# Altium project Table Clock.PrjPcb
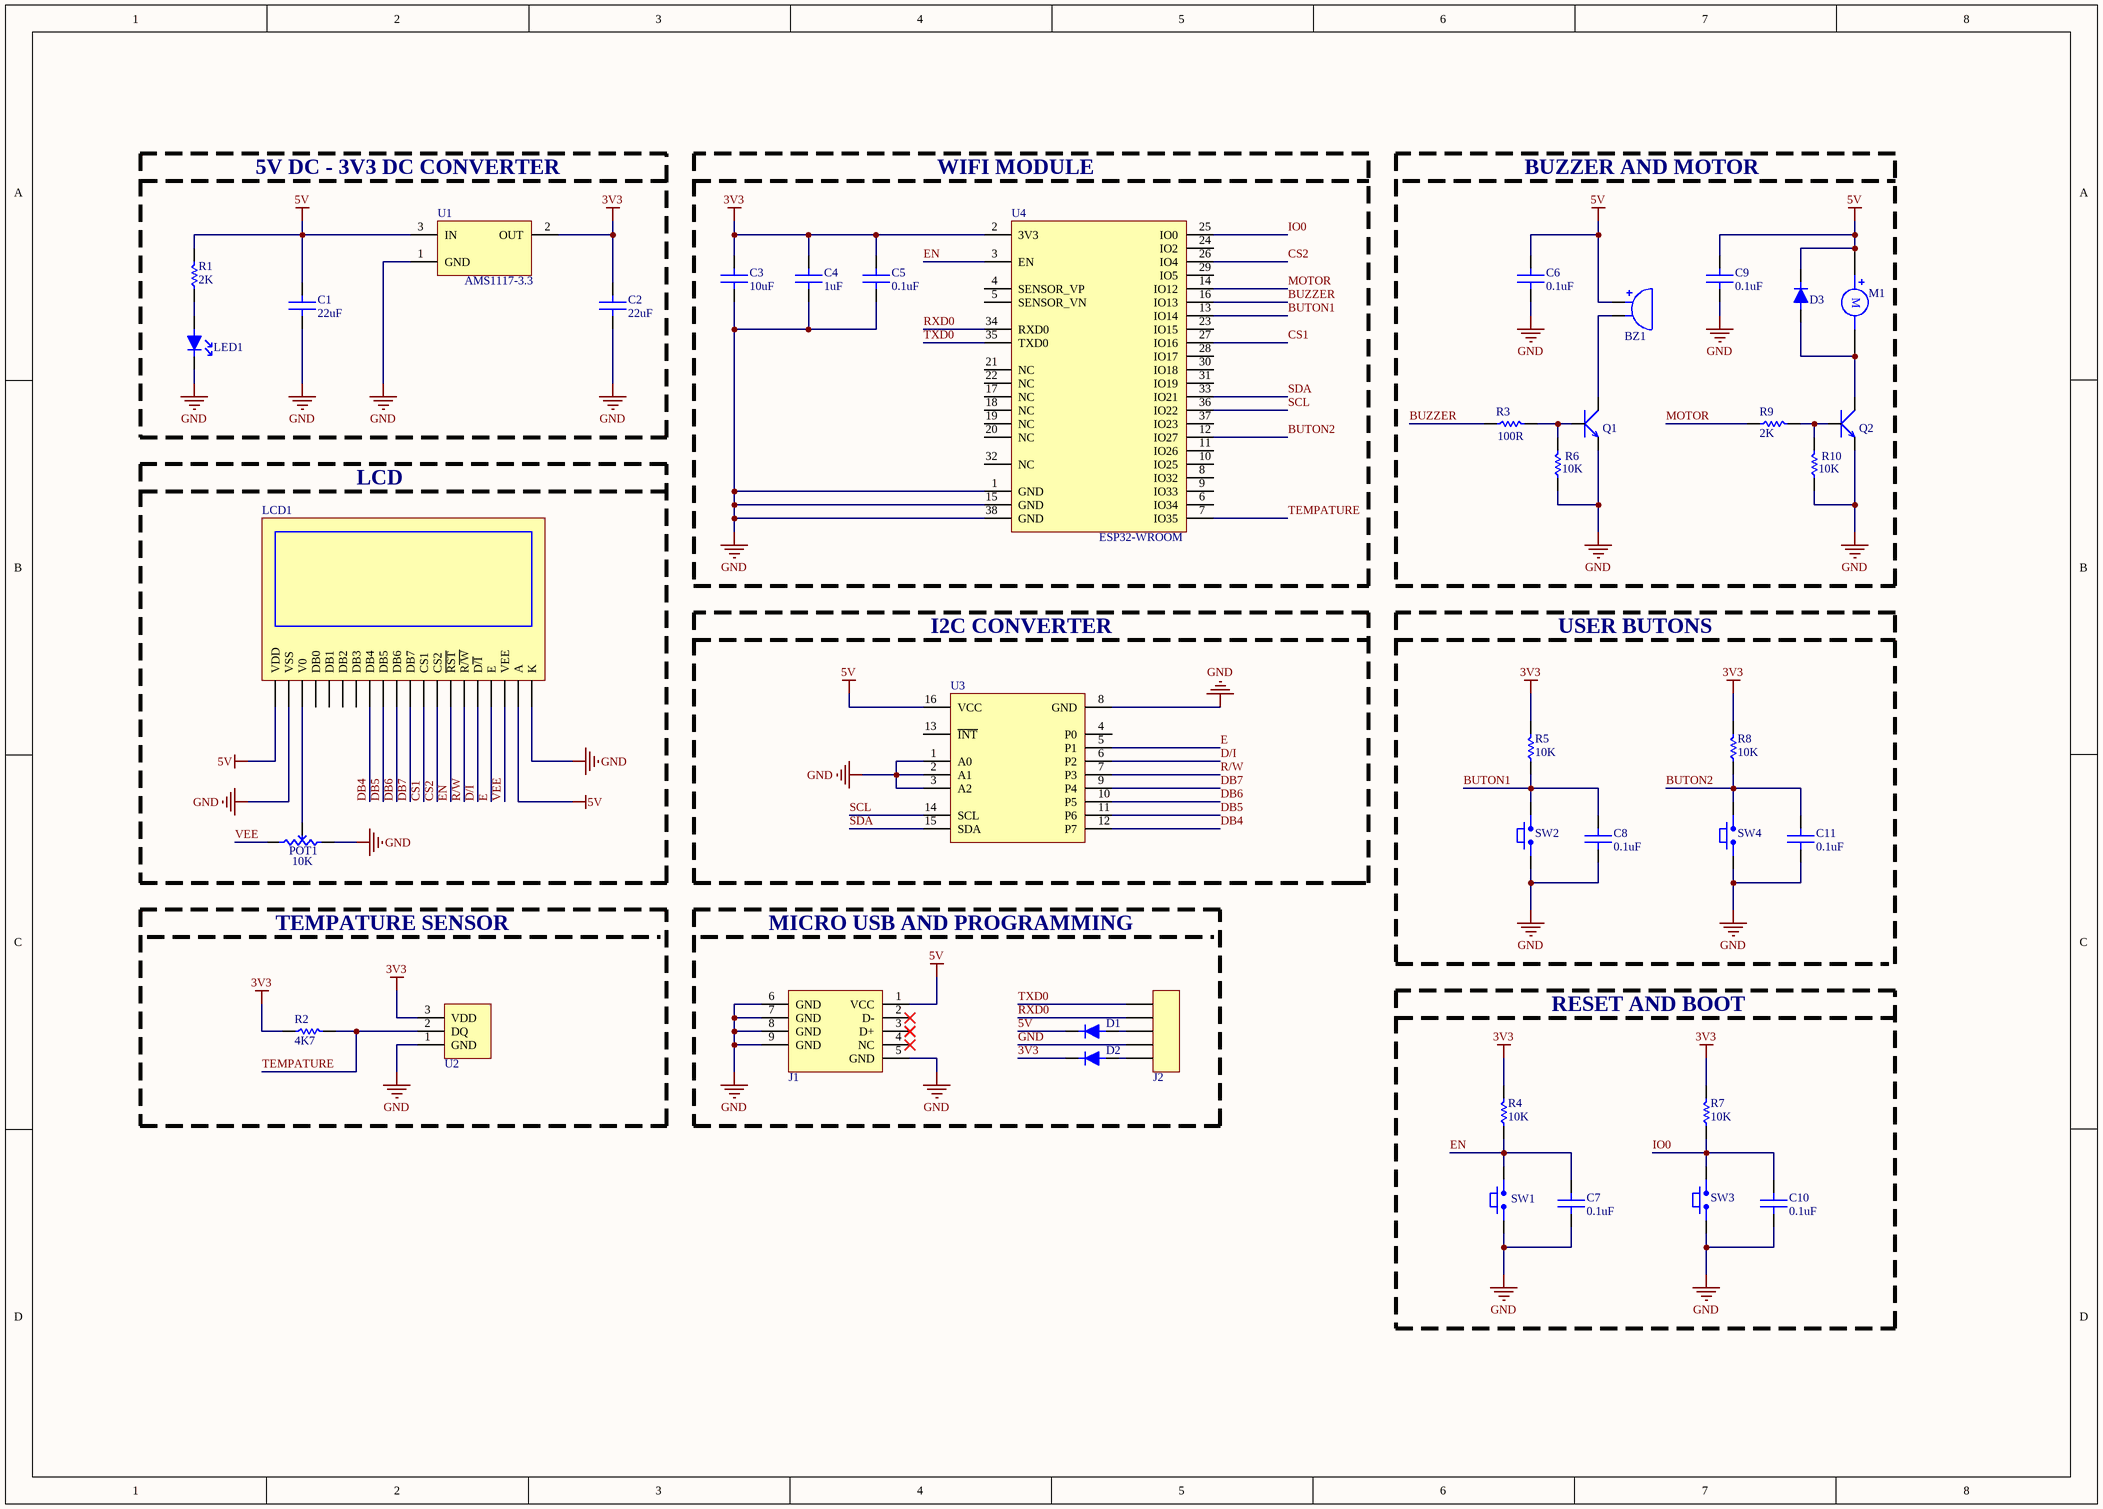
[diagram p0: Table Clock.SchDoc]
1 sheet, 41 parts. Net scope: global (net labels, ports and power ports of the same name join across sheets).
Board file: Table Clock.PcbDoc

## Sheet Table Clock.SchDoc
size A3; SheetNumber: 1; SheetTotal: 1

### Parts
BZ1  CMI-9605IC-0580T  [BUZZER]  (value not drawn)
C1  value 22uF  [CAP 0805]  (hidden comment: GRM21BR61E226ME44L)
C2  value 22uF  [CAP 0805]  (hidden comment: GRM21BR61E226ME44L)
C3  value 10uF  [CAP 0805]  (hidden comment: CC0805KKX5R8BB106)
C4  value 1uF  [CAP 0805]  (hidden comment: CC0805KKX7R9BB105)
C5  value 0.1uF  [CAP 0805]  (hidden comment: CC0805KRX7R9BB104)
C6  value 0.1uF  [CAP 0805]  (hidden comment: CC0805KRX7R9BB104)
C7  value 0.1uF  [CAP 0805]  (hidden comment: CC0805KRX7R9BB104)
C8  value 0.1uF  [CAP 0805]  (hidden comment: CC0805KRX7R9BB104)
C9  value 0.1uF  [CAP 0805]  (hidden comment: CC0805KRX7R9BB104)
C10  value 0.1uF  [CAP 0805]  (hidden comment: CC0805KRX7R9BB104)
C11  value 0.1uF  [CAP 0805]  (hidden comment: CC0805KRX7R9BB104)
D1  MBR230LSFT1G  [DIODE]  (value not drawn)
D2  MBR230LSFT1G  [DIODE]  (value not drawn)
D3  MBR230LSFT1G  [DIODE]  (value not drawn)
J1  UJ2-MIBH-G-SMT-TR  [MICRO USB]  (value not drawn)
J2  61300511121  [HEADER 5 POS]  (value not drawn)
LCD1  NHD-12864WG-BTFH-V#N  [LCD SCREEN]  (value not drawn)
LED1  150080RS75000  [LED 0805]  (value not drawn)
M1  HD-EM1003-LW15-R  [Motor]  (value not drawn)
POT1  value 10K  [TRIMMER]  (hidden comment: 3362P-1-103LF)
Q1  SS8050-G  [SOT23-3]  (value not drawn)
Q2  SS8050-G  [SOT23-3]  (value not drawn)
R1  value 2K  [RES 0603]  (hidden comment: CRGH0603J2K0)
R2  value 4K7  [RES 0603]  (hidden comment: CRGH0603J4K7)
R3  value 100R  [RES 0603]  (hidden comment: CRGH0603J100R)
R4  value 10K  [RES 0603]  (hidden comment: CRGH0603J10K)
R5  value 10K  [RES 0603]  (hidden comment: CRGH0603J10K)
R6  value 10K  [RES 0603]  (hidden comment: CRGH0603J10K)
R7  value 10K  [RES 0603]  (hidden comment: CRGH0603J10K)
R8  value 10K  [RES 0603]  (hidden comment: CRGH0603J10K)
R9  value 2K  [RES 0603]  (hidden comment: CRGH0603J2K0)
R10  value 10K  [RES 0603]  (hidden comment: CRGH0603J10K)
SW1  PTS636SM43SMTR LFS  [BUTTON]  (value not drawn)
SW2  PTS636SM50 LFS  [HEADER 2 POS]  (value not drawn)
SW3  PTS636SM43SMTR LFS  [BUTTON]  (value not drawn)
SW4  PTS636SM50 LFS  [HEADER 2 POS]  (value not drawn)
U1  AMS1117-3.3  [SOT 223]
U2  DS18B20  [HEADER 3 POS]  (value not drawn)
U3  PCF8574ADWR  [SOIC-16]  (value not drawn)
U4  value ESP32-WROOM  [ESP32]  (hidden comment: ESP32-WROOM-32E-H4)

### Blocks framed on the sheet
5V DC - 3V3 DC CONVERTER: C1 C2 LED1 R1 U1
WIFI MODULE: C3-C5 U4
BUZZER AND MOTOR: BZ1 C6 C9 D3 M1 Q1 Q2 R3 R6 R9 R10
LCD: LCD1 POT1
I2C CONVERTER: U3
MICRO USB AND PROGRAMMING: D1 D2 J1 J2
RESET AND BOOT: C7 C10 R4 R7 SW1 SW3

### Nets
3V3: C2.2 C3.2 C4.2 C5.2 D2.2 R2.1 R4.2 R5.2 R7.2 R8.2 U1.2(OUT) U2.3(VDD) U4.2(3V3)
5V: BZ1.1 C1.2 C6.2 C9.2 D1.2 D3.2 J1.1(VCC) LCD1.1(VDD) LCD1.19(A) M1.1 R1.2 U1.3(IN) U3.16(VCC)
GND: C1.1 C2.1 C3.1 C4.1 C5.1 C6.1 C7.1 C8.1 C9.1 C10.2 C11.1 J1.5(GND) J1.6(GND) J1.7(GND) J1.8(GND) J1.9(GND) J2.4 LCD1.2(VSS) LCD1.20(K) LED1.2 POT1.3 Q1.2 Q2.2 R6.1 R10.1 SW1.1 SW2.1 SW3.1 SW4.1 U1.1(GND) U2.1(GND) U3.1(A0) U3.2(A1) U3.3(A2) U3.8(GND) U4.1(GND) U4.15(GND) U4.38(GND)
BUTON1: C8.2 R5.1 SW2.2 U4.13(IO14)
BUTON2: C11.2 R8.1 SW4.2 U4.12(IO27)
BUZZER: R3.1 U4.16(IO13)
CS1: LCD1.12(CS1) U4.27(IO16)
CS2: LCD1.13(CS2) U4.26(IO4)
D/I: LCD1.16(D~{/I}) U3.6(P2)
DB4: LCD1.8(DB4) U3.12(P7)
DB5: LCD1.9(DB5) U3.11(P6)
DB6: LCD1.10(DB6) U3.10(P5)
DB7: LCD1.11(DB7) U3.9(P4)
E: LCD1.17(E) U3.5(P1)
EN: C7.2 LCD1.14(~{RST}) R4.1 SW1.2 U4.3(EN)
IO0: C10.1 R7.1 SW3.2 U4.25(IO0)
MOTOR: R9.1 U4.14(IO12)
R/W: LCD1.15(R~{/W}) U3.7(P3)
RXD0: J2.2 U4.34(RXD0)
SCL: U3.14(SCL) U4.36(IO22)
SDA: U3.15(SDA) U4.33(IO21)
TEMPATURE: R2.2 U2.2(DQ) U4.7(IO35)
TXD0: J2.1 U4.35(TXD0)
VEE: LCD1.18(VEE) POT1.1
NetBZ1_2: BZ1.2 Q1.3
NetD1_1: D1.1 J2.3
NetD2_1: D2.1 J2.5
NetD3_1: D3.1 M1.2 Q2.3
NetLCD1_3: LCD1.3(V0) POT1.2
NetLED1_1: LED1.1 R1.1
NetQ1_1: Q1.1 R3.2 R6.2
NetQ2_1: Q2.1 R9.2 R10.2

Not connected (* = marked no-connect by the designer): J1 2(D-)* 3(D+)* 4(NC)*; LCD1 4(DB0) 5(DB1) 6(DB2) 7(DB3); U3 4(P0) 13(~{INT}); U4 4(SENSOR_VP) 5(SENSOR_VN) 6(IO34) 8(IO32) 9(IO33) 10(IO25) 11(IO26) 17(NC) 18(NC) 19(NC) 20(NC) 21(NC) 22(NC) 23(IO15) 24(IO2) 28(IO17) 29(IO5) 30(IO18) 31(IO19) 32(NC) 37(IO23)

### Notes on the sheet
- USER BUTONS
- TEMPATURE SENSOR
- Dosya Adı / File Name
- Hazırlayan / Prepared By
- Tanım / Description
- Değiştirme Tarihi / Changed Date
- Bölüm / Department
- Onaylayan / Approved By
- Kontrol Eden / Checked By
- Boyut / Size
- Sayfa / Sheet
- Revizyon / Revision
- (in symbol VIBRATION DC MOTOR) M

### Library data of the parts
BZ1 = BUZZER: BUZZER MAGNETIC 5V 9.6MM TH
C1 C2 = CAP CER 22UF 0805: CAP CER 22UF 25V X5R 0805
C3 = CAP CER 10UF 0805: CAP CER 10UF 25V X5R 0805
C4 = CAP CER 1UF 0805: CAP CER 1UF 50V X7R 0805
C5-C11 = CAP CER 0.1UF 0805: CAP CER 0.1UF 50V X7R 0805
D1-D3 = DIODE SMD: DIODE SCHOTTKY 30V 2A
J1 = MICRO USB: USB JACK 2.0 MICRO B TYPE 5 P
J2 = HEADER 5 POS: CONN HEADER 5POS 2.54MM
LCD1 = LCD SCREEN: GRAPHIC DISPLAY LCD TH
LED1 = RED LED 0805: LED RED 0805 SMD
M1 = VIBRATION DC MOTOR: HD MOTOR 3VDC 46OHM 12000RPM
POT1 = TRIMMER: TRIMMER 10K OHM 0.5W PC PIN TOP
Q1 Q2 = NPN TRANSISTOR: TRANS NPN 25V 1.5A SOT-23-3
R1 R9 = RES 2K OHM 0603: RES 2K OHM 5% 1/5W 0603
R2 = RES 4K7 OHM 0603: RES 4.7K OHM 5% 1/5W 0603
R3 = RES 100 OHM 0603: RES 100 OHM 5% 1/5W 0603
R4-R8 R10 = RES 10K OHM 0603: RES 10K OHM 5% 1/5W 0603
SW1 SW3 = BUTTON: SWITCH TACTILE 0.05A 12V
SW2 SW4 = USER BUTTON: SWITCH TACTILE 0.05A 12V
U1 = LDO REG 3V3 1A: IC LDO REG 3.3V 1A SOT223 SMD; Value: AMS1117-3.3
U2 = TEMPATURE SENSOR: SENSOR DIGITAL -55C-125C TO92-3
U3 = I2C CONVERTER: IC XPNDR 100KHZ I2C 16SOIC
U4 = ESP32-WROOM: RF TXRX MOD BT WIFI TH SMD